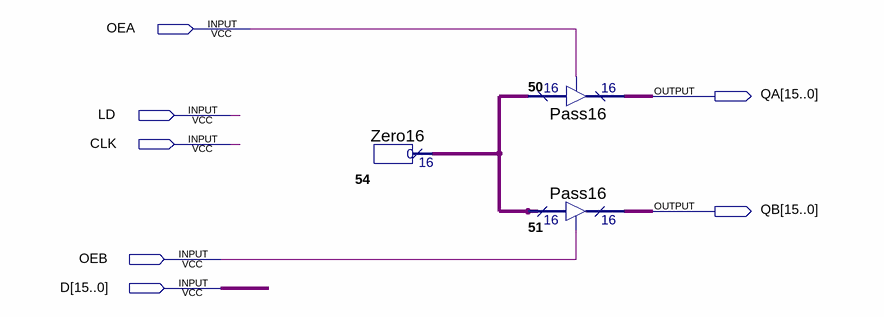
[diagram p0: schematic sheet]
// Quartus schematic zeroreg.bdf as structural Verilog: 3 symbols, 7 pins
module zeroreg (
  input  OEA,
  input  LD,
  input  CLK,
  input  OEB,
  input  [15:0] D,
  output [15:0] QA,
  output [15:0] QB
);

  wire [15:0] n54_result;

  Zero16 u_54 (.result(n54_result));
  Pass16 u_50 (.enabledt(OEA), .data(n54_result), .tridata(QA));
  Pass16 u_51 (.enabledt(OEB), .data(n54_result), .tridata(QB));
endmodule
